# Altium schematic sheet Sheet4.SchDoc
size A4
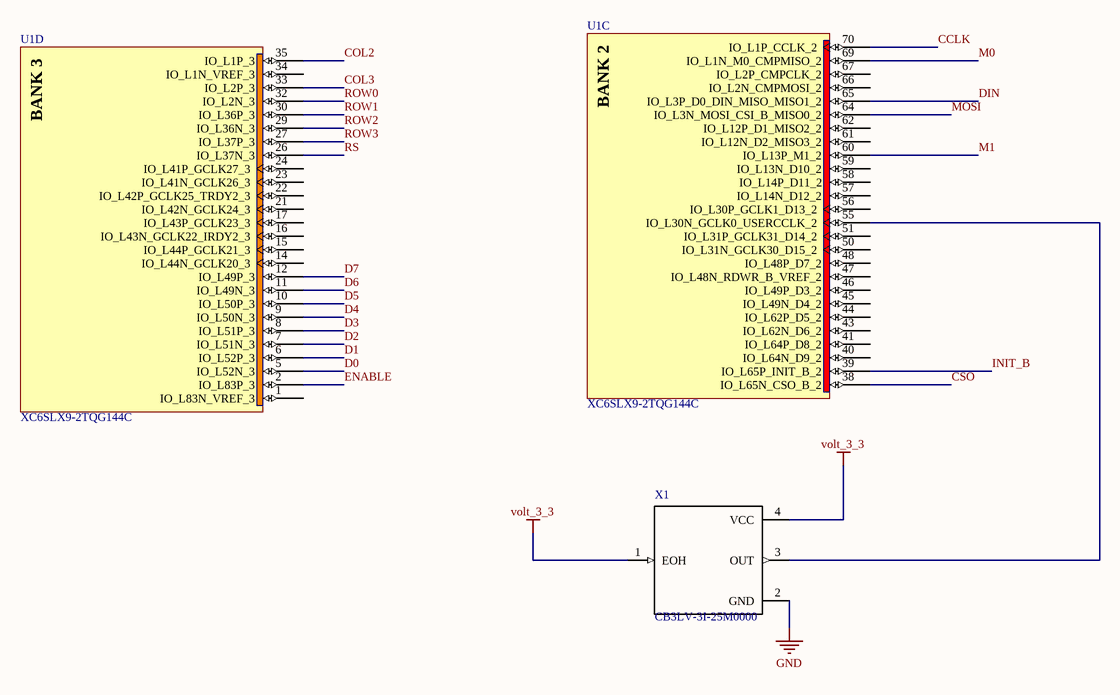
[diagram p0: Sheet4.SchDoc]

## Parts
U1  XC6SLX9-2TQG144C  [TQG144_N]  (parts C,D of 7)
X1  CB3LV-3I-25M0000  [*OSCCC700X500X180-4N]

## Nets
GND: X1.2(GND)
volt_3_3: X1.1(EOH) X1.4(VCC)
CCLK: U1.70(IO_L1P_CCLK_2)
COL2: U1.35(IO_L1P_3)
COL3: U1.33(IO_L2P_3)
CSO: U1.38(IO_L65N_CSO_B_2)
D0: U1.5(IO_L52N_3)
D1: U1.6(IO_L52P_3)
D2: U1.7(IO_L51N_3)
D3: U1.8(IO_L51P_3)
D4: U1.9(IO_L50N_3)
D5: U1.10(IO_L50P_3)
D6: U1.11(IO_L49N_3)
D7: U1.12(IO_L49P_3)
DIN: U1.65(IO_L3P_D0_DIN_MISO_MISO1_2)
ENABLE: U1.2(IO_L83P_3)
INIT_B: U1.39(IO_L65P_INIT_B_2)
M0: U1.69(IO_L1N_M0_CMPMISO_2)
M1: U1.60(IO_L13P_M1_2)
MOSI: U1.64(IO_L3N_MOSI_CSI_B_MISO0_2)
ROW0: U1.32(IO_L2N_3)
ROW1: U1.30(IO_L36P_3)
ROW2: U1.29(IO_L36N_3)
ROW3: U1.27(IO_L37P_3)
RS: U1.26(IO_L37N_3)
NetU1_55: U1.55(IO_L30N_GCLK0_USERCCLK_2) X1.3(OUT)

Not connected (* = marked no-connect by the designer): U1 1(IO_L83N_VREF_3) 14(IO_L44N_GCLK20_3) 15(IO_L44P_GCLK21_3) 16(IO_L43N_GCLK22_IRDY2_3) 17(IO_L43P_GCLK23_3) 21(IO_L42N_GCLK24_3) 22(IO_L42P_GCLK25_TRDY2_3) 23(IO_L41N_GCLK26_3) 24(IO_L41P_GCLK27_3) 34(IO_L1N_VREF_3) 40(IO_L64N_D9_2) 41(IO_L64P_D8_2) 43(IO_L62N_D6_2) 44(IO_L62P_D5_2) 45(IO_L49N_D4_2) 46(IO_L49P_D3_2) 47(IO_L48N_RDWR_B_VREF_2) 48(IO_L48P_D7_2) 50(IO_L31N_GCLK30_D15_2) 51(IO_L31P_GCLK31_D14_2) 56(IO_L30P_GCLK1_D13_2) 57(IO_L14N_D12_2) 58(IO_L14P_D11_2) 59(IO_L13N_D10_2) 61(IO_L12N_D2_MISO3_2) 62(IO_L12P_D1_MISO2_2) 66(IO_L2N_CMPMOSI_2) 67(IO_L2P_CMPCLK_2)

## Notes on the sheet
- (in symbol XC6SLX9-2TQG144C, part C) BANK 2
- (in symbol XC6SLX9-2TQG144C, part D) BANK 3

## Library data of the parts
U1 = XC6SLX9-2TQG144C: Spartan-6 LX 1.2V FPGA, 102 User I/Os, 144-Pin TQFP (0.5mm Pitch), Speed Grade 2, Commercial Grade, Pb-Free; DatasheetVersion: ver1.6, Nov-2010; PackageVersion: ver1.2, Jun-2004; PackageReference: TQG144; PackageDescription: 144-Pin Thin Quad Flat Pack (TQG144) - Pb-Free; Code_JEDEC: MS-026-BFB; ComponentLink1Description: Manufacturer URL; ComponentLink1URL: http://www.xilinx.com/; ComponentLink2Description: Spartan-6 Datasheet; ComponentLink2URL: http://www.xilinx.com/support/documentation/data_sheets/ds160.pdf; ComponentLink3Description: Spartan-6 Documents; ComponentLink3URL: http://www.xilinx.com/support/documentation/spartan-6.htm
X1 = CB3LV-3I-25M0000: CB3LV Series 25 MHz 7 x 5 mm 3.3 V آ±50 ppm SMT HCMOS/TTL Clock Oscillator; MF: CTS-Frequency; MP: CB3LV-3I-25M0000; SnapEDA_Link: https://www.snapeda.com/parts/CB3LV-3I-25M0000/CTS-Frequency%20Controls/view-part/?ref=snap; Package: SMD-4 CTS Components; Availability: Unavailable; Price: None; Value: *